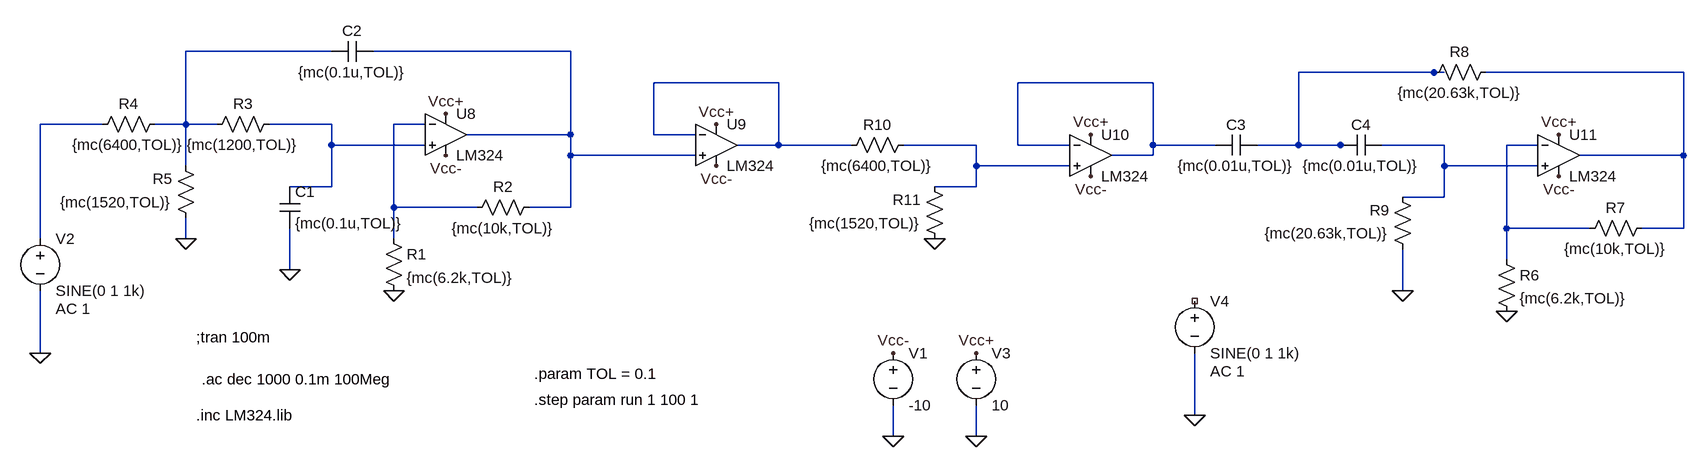
[diagram p0: schematic Lab4_simMontecarlo.asc]
Lab4_simMontecarlo.asc, the LTspice schematic file:
Version 4.1
SHEET 1 2244 700
WIRE -32 64 -256 64
WIRE 336 64 32 64
WIRE 1664 96 1456 96
WIRE 1680 96 1664 96
WIRE 2048 96 1744 96
WIRE 656 112 464 112
WIRE 1232 112 1024 112
WIRE -384 176 -480 176
WIRE -256 176 -256 64
WIRE -256 176 -304 176
WIRE -208 176 -256 176
WIRE -32 176 -128 176
WIRE 112 176 64 176
WIRE 336 192 336 64
WIRE 336 192 176 192
WIRE 464 192 464 112
WIRE 528 192 464 192
WIRE -32 208 -32 176
WIRE 112 208 -32 208
WIRE 656 208 656 112
WIRE 656 208 592 208
WIRE 768 208 656 208
WIRE 960 208 848 208
WIRE 1024 208 1024 112
WIRE 1104 208 1024 208
WIRE 1232 208 1232 112
WIRE 1328 208 1232 208
WIRE 1456 208 1456 96
WIRE 1456 208 1392 208
WIRE 1520 208 1456 208
WIRE 1536 208 1520 208
WIRE 1680 208 1584 208
WIRE 1824 208 1776 208
WIRE 336 224 336 192
WIRE 528 224 336 224
WIRE 1232 224 1232 208
WIRE 1232 224 1168 224
WIRE 2048 224 2048 96
WIRE 2048 224 1888 224
WIRE -256 240 -256 176
WIRE 960 240 960 208
WIRE 1104 240 960 240
WIRE 1680 240 1680 208
WIRE 1824 240 1680 240
WIRE -32 272 -32 208
WIRE -32 272 -96 272
WIRE 960 272 960 240
WIRE 960 272 896 272
WIRE 1680 288 1680 240
WIRE 1680 288 1616 288
WIRE 64 304 64 176
WIRE 192 304 64 304
WIRE 336 304 336 224
WIRE 336 304 272 304
WIRE 1776 336 1776 208
WIRE 1904 336 1776 336
WIRE 2048 336 2048 224
WIRE 2048 336 1984 336
WIRE -480 352 -480 176
WIRE -256 352 -256 320
WIRE 64 352 64 304
WIRE 1776 384 1776 336
WIRE -96 400 -96 336
WIRE 1616 432 1616 368
WIRE -480 528 -480 432
WIRE 1296 624 1296 528
WIRE 832 656 832 608
WIRE 960 656 960 608
FLAG 64 432 0
FLAG -480 528 0
FLAG 144 224 Vcc-
FLAG 144 160 Vcc+
FLAG -96 400 0
FLAG -256 352 0
FLAG 1776 464 0
FLAG 1296 624 0
FLAG 1856 256 Vcc-
FLAG 1856 192 Vcc+
FLAG 1616 432 0
FLAG 1136 192 Vcc+
FLAG 1136 256 Vcc-
FLAG 896 352 0
FLAG 560 176 Vcc+
FLAG 560 240 Vcc-
FLAG 832 656 0
FLAG 960 656 0
FLAG 832 528 Vcc-
FLAG 960 528 Vcc+
SYMBOL res 48 336 R0
SYMATTR InstName R1
SYMATTR Value {mc(6.2k,TOL)}
SYMATTR SpiceLine tol=10
SYMBOL res 288 288 R90
WINDOW 0 0 56 VBottom 2
WINDOW 3 32 56 VTop 2
SYMATTR InstName R2
SYMATTR Value {mc(10k,TOL)}
SYMATTR SpiceLine tol=10
SYMBOL voltage -480 336 R0
WINDOW 123 24 124 Left 2
WINDOW 39 0 0 Left 0
SYMATTR Value2 AC 1
SYMATTR InstName V2
SYMATTR Value SINE(0 1 1k)
SYMBOL cap -112 272 R0
SYMATTR InstName C1
SYMATTR Value {mc(0.1u,TOL)}
SYMBOL res -112 160 R90
WINDOW 0 0 56 VBottom 2
WINDOW 3 32 56 VTop 2
SYMATTR InstName R3
SYMATTR Value {mc(1200,TOL)}
SYMATTR SpiceLine tol=10
SYMBOL res -288 160 R90
WINDOW 0 0 56 VBottom 2
WINDOW 3 32 56 VTop 2
SYMATTR InstName R4
SYMATTR Value {mc(6400,TOL)}
SYMATTR SpiceLine tol=10
SYMBOL cap 32 48 R90
WINDOW 0 0 32 VBottom 2
WINDOW 3 32 32 VTop 2
SYMATTR InstName C2
SYMATTR Value {mc(0.1u,TOL)}
SYMBOL res -240 336 R180
WINDOW 0 36 76 Left 2
WINDOW 3 36 40 Left 2
SYMATTR InstName R5
SYMATTR Value {mc(1520,TOL)}
SYMATTR SpiceLine tol=10
SYMBOL res 1760 368 R0
SYMATTR InstName R6
SYMATTR Value {mc(6.2k,TOL)}
SYMATTR SpiceLine tol=10
SYMBOL res 2000 320 R90
WINDOW 0 0 56 VBottom 2
WINDOW 3 32 56 VTop 2
SYMATTR InstName R7
SYMATTR Value {mc(10k,TOL)}
SYMATTR SpiceLine tol=10
SYMBOL voltage 1296 432 R0
WINDOW 123 24 124 Left 2
WINDOW 39 0 0 Left 0
SYMATTR Value2 AC 1
SYMATTR InstName V4
SYMATTR Value SINE(0 1 1k)
SYMBOL res 1760 80 R90
WINDOW 0 0 56 VBottom 2
WINDOW 3 32 56 VTop 2
SYMATTR InstName R8
SYMATTR Value {mc(20.63k,TOL)}
SYMATTR SpiceLine tol=10
SYMBOL res 1632 384 R180
WINDOW 0 36 76 Left 2
WINDOW 3 36 40 Left 2
SYMATTR InstName R9
SYMATTR Value {mc(20.63k,TOL)}
SYMATTR SpiceLine tol=10
SYMBOL cap 1392 192 R90
WINDOW 0 0 32 VBottom 2
WINDOW 3 32 32 VTop 2
SYMATTR InstName C3
SYMATTR Value {mc(0.01u,TOL)}
SYMBOL cap 1584 192 R90
WINDOW 0 0 32 VBottom 2
WINDOW 3 32 32 VTop 2
SYMATTR InstName C4
SYMATTR Value {mc(0.01u,TOL)}
SYMBOL res 864 192 R90
WINDOW 0 0 56 VBottom 2
WINDOW 3 32 56 VTop 2
SYMATTR InstName R10
SYMATTR Value {mc(6400,TOL)}
SYMATTR SpiceLine tol=10
SYMBOL res 912 368 R180
WINDOW 0 36 76 Left 2
WINDOW 3 36 40 Left 2
SYMATTR InstName R11
SYMATTR Value {mc(1520,TOL)}
SYMATTR SpiceLine tol=10
SYMBOL OpAmps\\opamp2 144 128 R0
SYMATTR InstName U8
SYMATTR Value LM324
SYMBOL OpAmps\\opamp2 560 144 R0
SYMATTR InstName U9
SYMATTR Value LM324
SYMBOL OpAmps\\opamp2 1136 160 R0
SYMATTR InstName U10
SYMATTR Value LM324
SYMBOL OpAmps\\opamp2 1856 160 R0
SYMATTR InstName U11
SYMATTR Value LM324
SYMBOL voltage 832 512 R0
WINDOW 123 0 0 Left 0
WINDOW 39 0 0 Left 0
SYMATTR InstName V1
SYMATTR Value -10
SYMBOL voltage 960 512 R0
WINDOW 123 0 0 Left 0
WINDOW 39 0 0 Left 0
SYMATTR InstName V3
SYMATTR Value 10
TEXT -240 504 Left 2 !;tran 100m
TEXT -232 568 Left 2 !.ac dec 1000 0.1m 100Meg
TEXT 280 560 Left 2 !.param TOL = 0.1
TEXT 280 600 Left 2 !.step param run 1 100 1
TEXT -240 624 Left 2 !.inc LM324.lib

The netlist it stands for:
* Lab4_simMontecarlo.asc
R1 N009 0 {mc(6.2k,TOL)} tol=10
R2 N002 N009 {mc(10k,TOL)} tol=10
V2 N007 0 SINE(0 1 1k) AC 1
C1 N008 0 {mc(0.1u,TOL)}
R3 N008 N001 {mc(1200,TOL)} tol=10
R4 N001 N007 {mc(6400,TOL)} tol=10
C2 N002 N001 {mc(0.1u,TOL)}
R5 0 N001 {mc(1520,TOL)} tol=10
R6 N012 0 {mc(6.2k,TOL)} tol=10
R7 N004 N012 {mc(10k,TOL)} tol=10
V4 NC_01 0 SINE(0 1 1k) AC 1
R8 N004 N003 {mc(20.63k,TOL)} tol=10
R9 0 N011 {mc(20.63k,TOL)} tol=10
C3 N003 N006 {mc(0.01u,TOL)}
C4 N011 N003 {mc(0.01u,TOL)}
R10 N010 N005 {mc(6400,TOL)} tol=10
R11 0 N010 {mc(1520,TOL)} tol=10
X§U8 N008 N009 Vcc+ Vcc- N002 LM324  ; pins In+ In- V+ V- OUT
X§U9 N002 N005 Vcc+ Vcc- N005 LM324  ; pins In+ In- V+ V- OUT
X§U10 N010 N006 Vcc+ Vcc- N006 LM324  ; pins In+ In- V+ V- OUT
X§U11 N011 N012 Vcc+ Vcc- N004 LM324  ; pins In+ In- V+ V- OUT
V1 Vcc- 0 -10
V3 Vcc+ 0 10
;tran 100m
.ac dec 1000 0.1m 100Meg
.param TOL = 0.1
.step param run 1 100 1
.inc LM324.lib
.backanno
.end